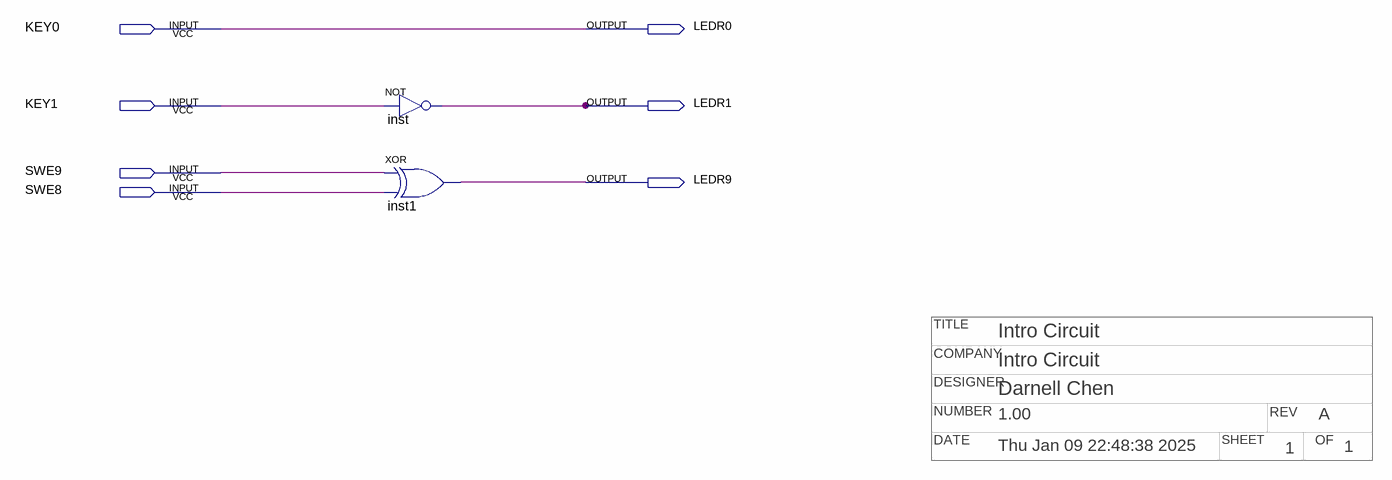
[diagram p0: schematic sheet]
// Quartus schematic IntroCircuit.bdf as structural Verilog: 2 symbols, 7 pins
// Title block: COMPANY: Intro Circuit; DATE: Thu Jan 09 22:48:38 2025; DESIGNER: Darnell Chen; NUMBER: 1.00; OF: 1; REV: A; SHEET: 1; TITLE: Intro Circuit
module IntroCircuit (
  input  KEY0,
  input  KEY1,
  input  SWE9,
  input  SWE8,
  output LEDR0,
  output LEDR1,
  output LEDR9
);

  not inst (LEDR1, KEY1);
  xor inst1 (LEDR9, SWE9, SWE8);

  assign LEDR0 = KEY0;
endmodule
